# Altium schematic sheet STM32F103.SchDoc
size A3; SheetNumber: 1; SheetTotal: 6
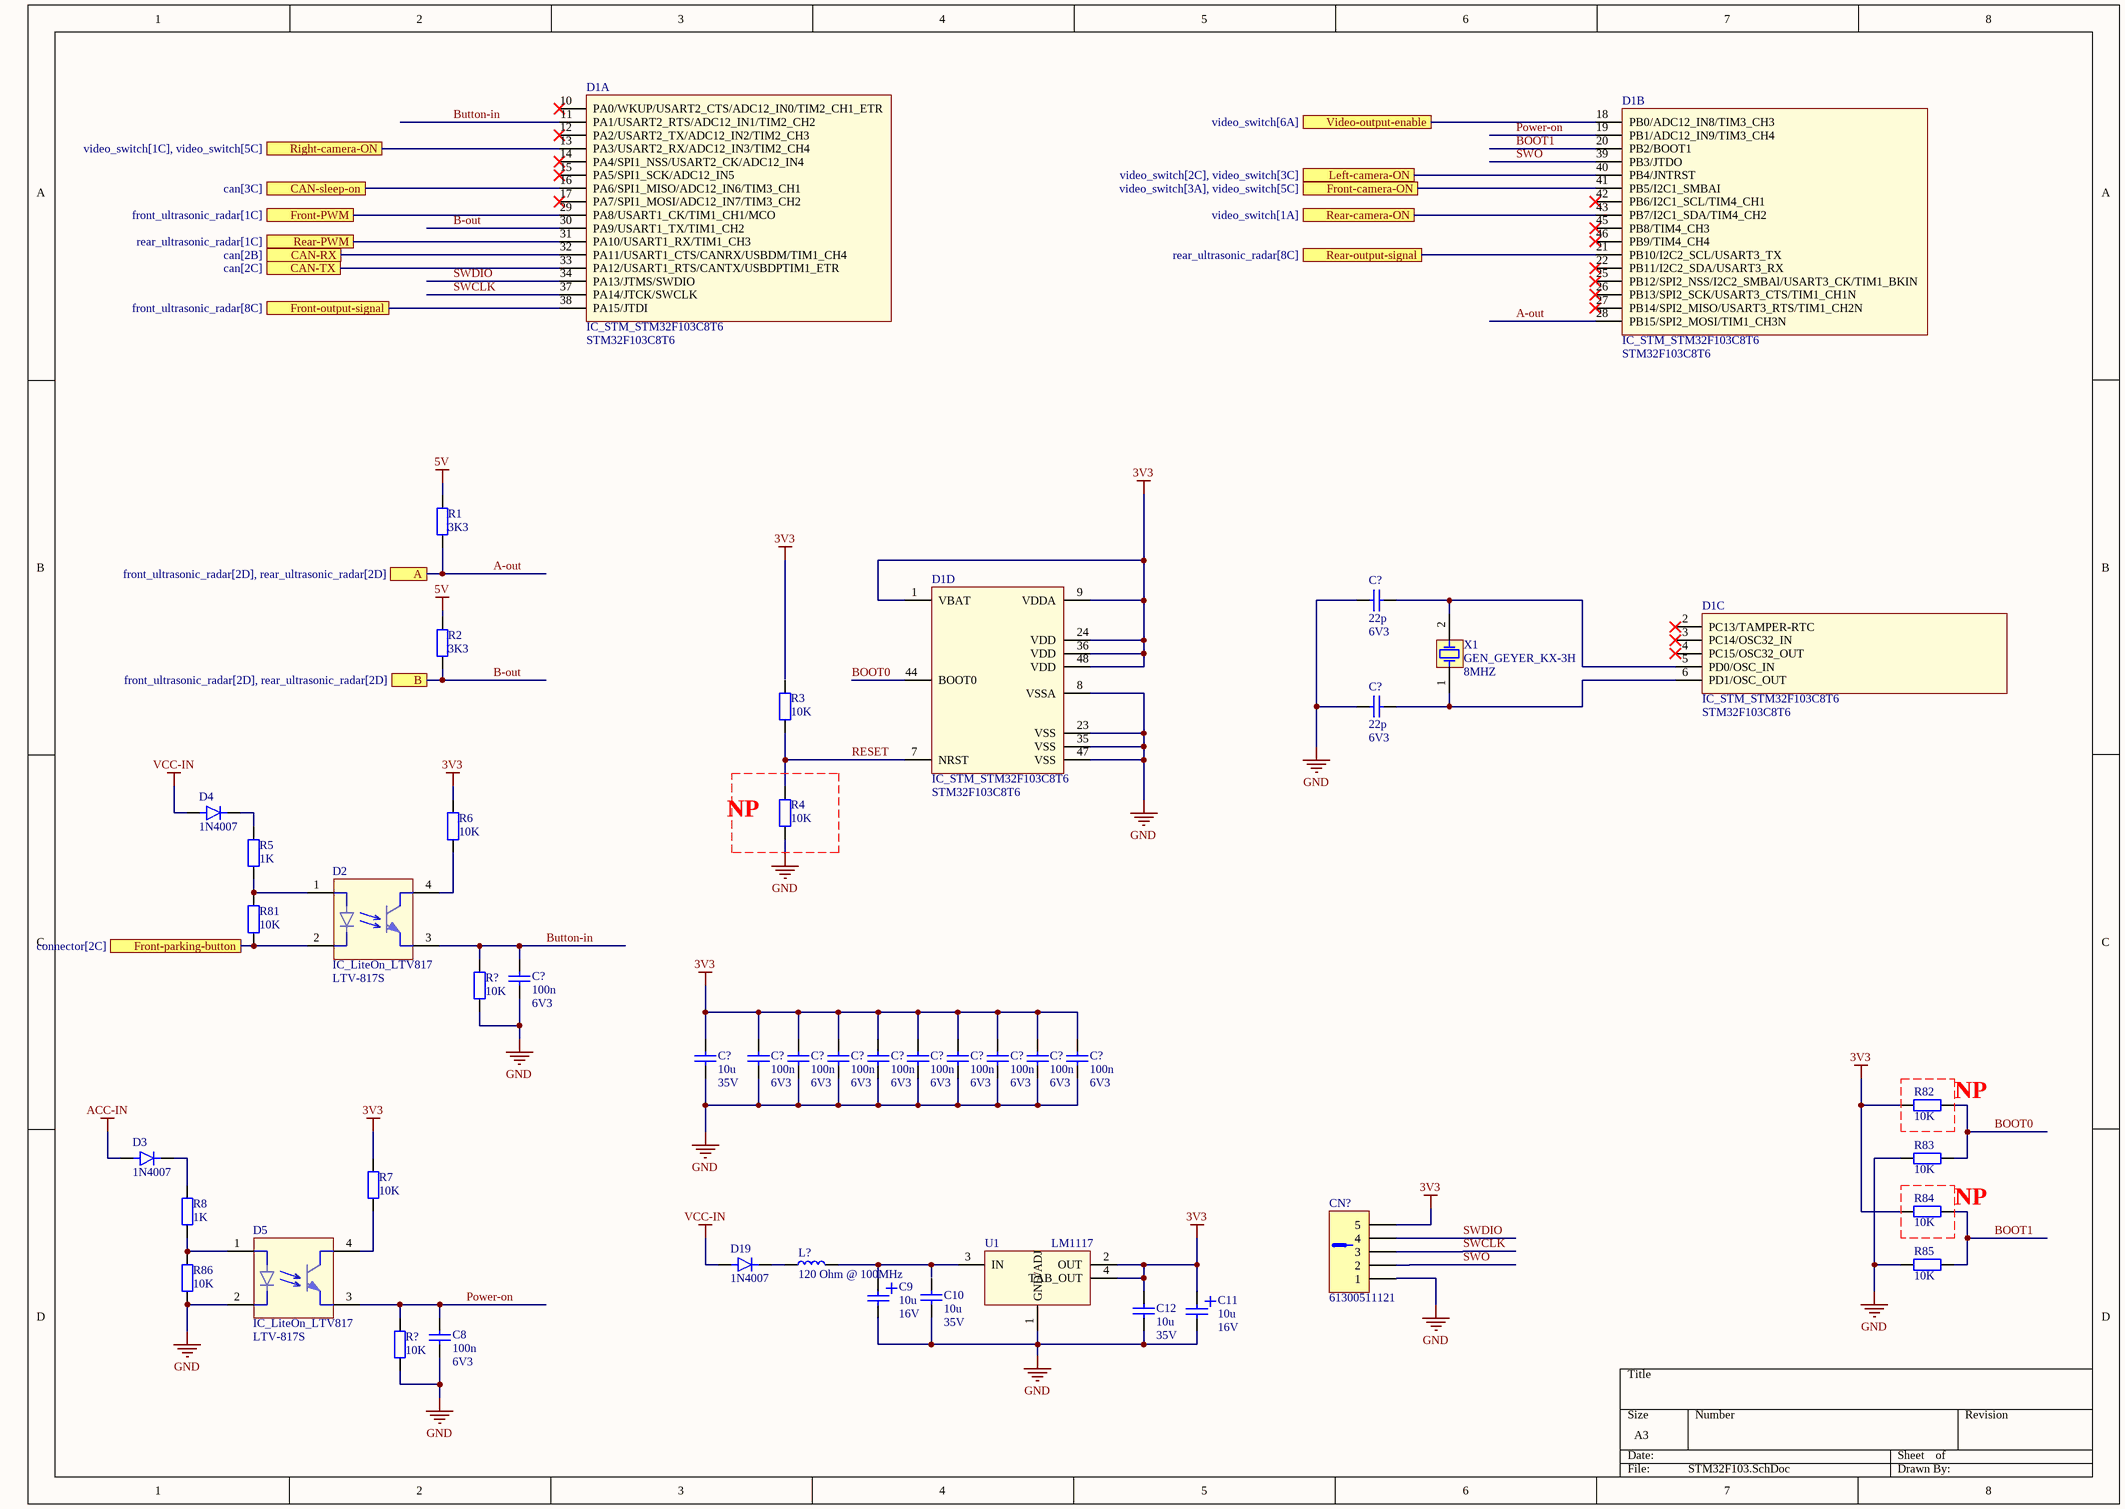
[diagram p0: STM32F103.SchDoc]

## Parts
(Parts that share a designator on the sheet are numbered #1, #2 ... from top to bottom, then left to right.)
C8  Value1: 100n  Value2: 6V3  [CAPC2012X88N]  (hidden comment: CAP)
C9  Value1: 10u  Value2: 16V  [CAPAE430X550N]  (hidden comment: CAP_POL)
C10  Value1: 10u  Value2: 35V  [CAPC3216X18N]  (hidden comment: CAP)
C11  Value1: 10u  Value2: 16V  [CAPAE430X550N]  (hidden comment: CAP_POL)
C12  Value1: 10u  Value2: 35V  [CAPC3216X18N]  (hidden comment: CAP)
C?#1  Value1: 22p  Value2: 6V3  [CAPC2012X88N]  (hidden comment: CAP)
C?#2  Value1: 22p  Value2: 6V3  [CAPC2012X88N]  (hidden comment: CAP)
C?#3  Value1: 100n  Value2: 6V3  [CAPC2012X88N]  (hidden comment: CAP)
C?#4  Value1: 10u  Value2: 35V  [CAPC3216X18N]  (hidden comment: CAP)
C?#5  Value1: 100n  Value2: 6V3  [CAPC2012X88N]  (hidden comment: CAP)
C?#6  Value1: 100n  Value2: 6V3  [CAPC2012X88N]  (hidden comment: CAP)
C?#7  Value1: 100n  Value2: 6V3  [CAPC2012X88N]  (hidden comment: CAP)
C?#8  Value1: 100n  Value2: 6V3  [CAPC2012X88N]  (hidden comment: CAP)
C?#9  Value1: 100n  Value2: 6V3  [CAPC2012X88N]  (hidden comment: CAP)
C?#10  Value1: 100n  Value2: 6V3  [CAPC2012X88N]  (hidden comment: CAP)
C?#11  Value1: 100n  Value2: 6V3  [CAPC2012X88N]  (hidden comment: CAP)
C?#12  Value1: 100n  Value2: 6V3  [CAPC2012X88N]  (hidden comment: CAP)
C?#13  Value1: 100n  Value2: 6V3  [CAPC2012X88N]  (hidden comment: CAP)
CN?  Value1: 61300511121  [CN_Wurth_61300511121]  (hidden comment: CN_1X5M)
D1  IC_STM_STM32F103C8T6  Value1: STM32F103C8T6  [TSQFP50P900X900X160-48N]  (parts A,B,C,D of 4)
D2  IC_LiteOn_LTV817  Value1: LTV-817S  [IC_LiteOn_ LTV-817S]
D3  Value1: 1N4007  [DO-214AC]  (hidden comment: DIO)
D4  Value1: 1N4007  [DO-214AC]  (hidden comment: DIO)
D5  IC_LiteOn_LTV817  Value1: LTV-817S  [IC_LiteOn_ LTV-817S]
D19  Value1: 1N4007  [DO-214AC]  (hidden comment: DIO)
L?  Value1: 120 Ohm @ 100MHz  [INDC1608X60N]  (hidden comment: IND)
R1  Value1: 3K3  [RESC2012X60N]  (hidden comment: RES)
R2  Value1: 3K3  [RESC2012X60N]  (hidden comment: RES)
R3  Value1: 10K  [RESC2012X60N]  (hidden comment: RES)
R4  Value1: 10K  [RESC2012X60N]  (hidden comment: RES)
R5  Value1: 1K  [RESC2012X60N]  (hidden comment: RES)
R6  Value1: 10K  [RESC2012X60N]  (hidden comment: RES)
R7  Value1: 10K  [RESC2012X60N]  (hidden comment: RES)
R8  Value1: 1K  [RESC2012X60N]  (hidden comment: RES)
R81  Value1: 10K  [RESC2012X60N]  (hidden comment: RES)
R82  Value1: 10K  [RESC2012X60N]  (hidden comment: RES)
R83  Value1: 10K  [RESC2012X60N]  (hidden comment: RES)
R84  Value1: 10K  [RESC2012X60N]  (hidden comment: RES)
R85  Value1: 10K  [RESC2012X60N]  (hidden comment: RES)
R86  Value1: 10K  [RESC2012X60N]  (hidden comment: RES)
R?#1  Value1: 10K  [RESC2012X60N]  (hidden comment: RES)
R?#2  Value1: 10K  [RESC2012X60N]  (hidden comment: RES)
U1  Value1: LM1117  [IC_TI_LM1117]  (hidden comment: IC_TI_LM1117)
X1  GEN_GEYER_KX-3H  Value1: 8MHZ  [GEN_GEYER_KX-3H]

## Ports
A (see front_ultrasonic_radar[2D], rear_ultrasonic_radar[2D]), B (see front_ultrasonic_radar[2D], rear_ultrasonic_radar[2D]), CAN-RX (see can[2B]), CAN-sleep-on (see can[3C]), CAN-TX (see can[2C]), Front-camera-ON (see video_switch[3A], video_switch[5C]), Front-output-signal (see front_ultrasonic_radar[8C]), Front-parking-button (see connector[2C]), Front-PWM (see front_ultrasonic_radar[1C]), Left-camera-ON (see video_switch[2C], video_switch[3C]), Rear-camera-ON (see video_switch[1A]), Rear-output-signal (see rear_ultrasonic_radar[8C]), Rear-PWM (see rear_ultrasonic_radar[1C]), Right-camera-ON (see video_switch[1C], video_switch[5C]), Video-output-enable (see video_switch[6A])

## Nets
3V3: C11.1 C?#4.2 C?#5.2 C?#6.2 C?#7.2 C?#8.2 C?#9.2 C?#10.2 C?#11.2 C?#12.2 C?#13.2 CN?.5 D1.1(VBAT) D1.9(VDDA) D1.24(VDD) D1.36(VDD) D1.48(VDD) R6.2 R7.2 R82.1 R84.1 U1.2(OUT) U1.4(TAB_OUT)
5V: R1.2 R2.2
ACC-IN: D3.1(A)
GND: C8.1 C9.2 C10.1 C11.2 C12.1 C?#1.1 C?#2.1 C?#3.1 C?#4.1 C?#5.1 C?#6.1 C?#7.1 C?#8.1 C?#9.1 C?#10.1 C?#11.1 C?#12.1 C?#13.1 CN?.1 D1.8(VSSA) D1.23(VSS) D1.35(VSS) D1.47(VSS) D5.2 R4.1 R83.1 R85.1 R86.1 R?#1.1 R?#2.1 U1.1(GND/ADJ)
VCC-IN: D4.1(A) D19.1(A)
A-out: D1.28(PB15/SPI2_MOSI/TIM1_CH3N) R1.1 ; port A
B-out: D1.30(PA9/USART1_TX/TIM1_CH2) R2.1 ; port B
BOOT0: D1.44(BOOT0) R82.2 R83.2
BOOT1: D1.20(PB2/BOOT1) R84.2 R85.2
Button-in: C?#3.2 D1.11(PA1/USART2_RTS/ADC12_IN1/TIM2_CH2) D2.3 R?#1.2
CAN-RX: D1.32(PA11/USART1_CTS/CANRX/USBDM/TIM1_CH4) ; port CAN-RX
CAN-sleep-on: D1.16(PA6/SPI1_MISO/ADC12_IN6/TIM3_CH1) ; port CAN-sleep-on
CAN-TX: D1.33(PA12/USART1_RTS/CANTX/USBDPTIM1_ETR) ; port CAN-TX
Front-camera-ON: D1.41(PB5/I2C1_SMBAI) ; port Front-camera-ON
Front-output-signal: D1.38(PA15/JTDI) ; port Front-output-signal
Front-parking-button: D2.2 R81.1 ; port Front-parking-button
Front-PWM: D1.29(PA8/USART1_CK/TIM1_CH1/MCO) ; port Front-PWM
Left-camera-ON: D1.40(PB4/JNTRST) ; port Left-camera-ON
Power-on: C8.2 D1.19(PB1/ADC12_IN9/TIM3_CH4) D5.3 R?#2.2
Rear-camera-ON: D1.43(PB7/I2C1_SDA/TIM4_CH2) ; port Rear-camera-ON
Rear-output-signal: D1.21(PB10/I2C2_SCL/USART3_TX) ; port Rear-output-signal
Rear-PWM: D1.31(PA10/USART1_RX/TIM1_CH3) ; port Rear-PWM
RESET: D1.7(NRST) R3.1
Right-camera-ON: D1.13(PA3/USART2_RX/ADC12_IN3/TIM2_CH4) ; port Right-camera-ON
SWCLK: CN?.3 D1.37(PA14/JTCK/SWCLK)
SWDIO: CN?.4 D1.34(PA13/JTMS/SWDIO)
SWO: CN?.2 D1.39(PB3/JTDO)
Video-output-enable: D1.18(PB0/ADC12_IN8/TIM3_CH3) ; port Video-output-enable
NetC9_1: C9.1 L?.1 U1.3(IN)
NetC?#1_2: C?#1.2 D1.5(PD0/OSC_IN) X1.2
NetC?#2_2: C?#2.2 D1.6(PD1/OSC_OUT) X1.1
NetD2_1: D2.1 R5.1 R81.2
NetD2_4: D2.4 R6.1
NetD3_2: D3.2(K) R8.2
NetD4_2: D4.2(K) R5.2
NetD5_1: D5.1 R8.1 R86.2
NetD5_4: D5.4 R7.1
NetD19_2: D19.2(K) L?.2

Not connected (* = marked no-connect by the designer): C10 2; C12 2; D1 2(PC13/TAMPER-RTC)* 3(PC14/OSC32_IN)* 4(PC15/OSC32_OUT)* 10(PA0/WKUP/USART2_CTS/ADC12_IN0/TIM2_CH1_ETR)* 12(PA2/USART2_TX/ADC12_IN2/TIM2_CH3)* 14(PA4/SPI1_NSS/USART2_CK/ADC12_IN4)* 15(PA5/SPI1_SCK/ADC12_IN5)* 17(PA7/SPI1_MOSI/ADC12_IN7/TIM3_CH2)* 22(PB11/I2C2_SDA/USART3_RX)* 25(PB12/SPI2_NSS/I2C2_SMBAl/USART3_CK/TIM1_BKIN)* 26(PB13/SPI2_SCK/USART3_CTS/TIM1_CH1N)* 27(PB14/SPI2_MISO/USART3_RTS/TIM1_CH2N)* 42(PB6/I2C1_SCL/TIM4_CH1)* 45(PB8/TIM4_CH3)* 46(PB9/TIM4_CH4)*; R3 2; R4 2

## Notes on the sheet
- (near R4) NP
- (near R82) NP
- (near R84) NP

## Library data of the parts
C8 C?#3 C?#5-C?#13 = 01_00637: X7R 10% 0805; Manufacturer: KEMET; Manufacturer PN: C0805C104K9RACTU; AutoId: 637; DeviceType: capacitor; SubType: Ceramic; Id: 01_00637; Status: 2 - Checked and Approved; MountType: SMT; ComponentLink1URL: X:\01_Datasheets\CAP_KEMET_CxxxxCxxxXxRAC.pdf; Supplier 1: Farnell; Supplier Part Number 1: 80-C0805C104K9R; ComponentLink1Description: Datasheet
C9 C11 = 01_01399: ELCO 20%; Manufacturer: Nichicon; Manufacturer PN: UWF1C100MCL1GB; AutoId: 1399; DeviceType: capacitor; SubType: Electrolyte; Id: 01_01399; Status: 2 - Checked and Approved; MountType: SMT; ComponentLink1URL: X:\01_Datasheets\CAP_NICHICON_UWF1C100MCL1GB.pdf; Supplier 1: Farnell; Supplier Part Number 1: 647-UWF1C100MCL1GB; ComponentLink1Description: Datasheet
C10 C12 C?#4 = 01_01484: MURATA - GRM31CR6YA106KA12L - CAP, MLCC, X5R, 10UF, 35V, 1206; AutoId: 1484; DeviceType: capacitor; SubType: Ceramic; Id: 01_01484; Manufacturer: Murata; Manufacturer PN: GRM31CR6YA106KA12L; Status: 2 - Checked and Approved; MountType: SMD; ComponentLink1URL: X:\01_dataSheets\CAP_MURATA_GRM31CR6YA106KA12L.pdf; Supplier 1: Farnell; Supplier Part Number 1: 1797011; ComponentLink1Description: Datasheet
C?#1 C?#2 = 01_00593: X7R 10% 0805; Manufacturer: KEMET; Manufacturer PN: C0805C220K9RACTU; AutoId: 593; DeviceType: capacitor; SubType: Ceramic; Id: 01_00593; Status: 2 - Checked and Approved; MountType: SMT; ComponentLink1URL: X:\01_Datasheets\CAP_KEMET_CxxxxCxxxXxRAC.pdf; Supplier 1: Farnell; ComponentLink1Description: Datasheet
CN? = 02_00139: Headers & Wire Housings WR-PHD 2.54mm Hdr 5P Single Str Gold; Manufacturer: Wurth; AutoId: 139; Value2: 5 pin; Value3: header; DeviceType: Connector_; Id: 02_00139; Manufacturer PN: 61300511121; Status: 0 - Unchecked; MountType: THT; ComponentLink1Description: Datasheet; ComponentLink1URL: X:\01_Datasheets\CN_Wurth_61300511121.pdf; ComponentLink2Description: ComponentVerificationSheet; ComponentLink2URL: X:\02_ComponentVerificationSheets\; Supplier 1: Mouser; Supplier Part Number 1: 710-61300511121
D1 = 07_00285: MCU 32BIT Cortex M3 64KB 20KB RAM 2X12 ADC; Manufacturer: STM; AutoId: 292; Value2: Microcontroller; Value3: ARM 32bit; DeviceType: IC; Id: 07_00285; Manufacturer PN: STM32F103C8T6; Status: 0 - Unchecked; MountType: SMT; ComponentLink1Description: Datasheet; ComponentLink1URL: X:\01_Datasheets\IC_STM_STM32F103C8T6.pdf; ComponentLink2Description: ComponentVerificationSheet; ComponentLink2URL: X:\02_ComponentVerificationSheets\; Supplier 1: Mouser; Supplier Part Number 1: 511-STM32F103C8T6
D2 D5 = 07_00275: Transistor Output Optocouplers Optocoupler Phototrans; Manufacturer: Lite-On; AutoId: 276; Id: 07_00275; Value2: Optocouplers; Value3: Optocouplers; Manufacturer PN: LTV-817S; DeviceType: Optocouple; Status: 0 - Unchecked; MountType: SMT; ComponentLink1Description: Datasheet; ComponentLink1URL: X:\01_Datasheets\IC_Lite_On_LTV-817S.pdf; ComponentLink2Description: ComponentVerificationSheet; ComponentLink2URL: X:\02_ComponentVerificationSheets\; Supplier 1: Mouser; Supplier Part Number 1: 859-LTV-817S
D3 D4 D19 = 03_00099: M7 Diode, max 30A; AutoId: 117; Value2: 1A, 400V; Id: 03_00099; Value3: M7; Manufacturer PN: 1N4007; DeviceType: diode; ComponentLink1Description: Datasheet; ComponentLink1URL: X:\01_Datasheets\; ComponentLink2Description: ComponentVerificationSheet; ComponentLink2URL: X:\02_ComponentVerificationSheets\
L? = 08_00132: MURATA - BLM18KG121TN1D - FERRITE BEAD, 0603, 120R, 3A; AutoId: 132; DeviceType: inductor; Id: 08_00132; Value2: 3A; Manufacturer: Murata; Manufacturer PN: BLM18KG121TN1D; Status: 0 - Unchecked; MountType: SMD; ComponentLink1Description: Datasheet; ComponentLink1URL: X:\01_dataSheets\IND_MURATA_BLM18K.pdf; ComponentLink2Description: ComponentVerificationSheet; ComponentLink2URL: X:\02_ComponentVerificationSheets\; Supplier 1: Farnell; Supplier Part Number 1: 1781089
R1 R2 = 15_00335: RESISTOR, 0805, 3K3, 1%, SMD; Manufacturer: Yageo; Manufacturer PN: RC0805FR-073K3; AutoId: 335; Value2: 0W125; SubType: Metal film; Id: 15_00335; DeviceType: resistor; Status: 2 - Checked and Approved; MountType: SMT; ComponentLink1Description: Datasheet; ComponentLink1URL: X:\01_Datasheets\RES_YAGEO_RC0805FR.pdf; Supplier 1: Farnell; Supplier Part Number 1: 9237682
R3 R4 R6 R7 R81-R86 R?#1 R?#2 = 15_00341: RESISTOR, 0805, 10K, 1%, SMD; Manufacturer: Yageo; Manufacturer PN: RC0805FR-0710K; AutoId: 341; Value2: 0W125; SubType: Metal film; Id: 15_00341; DeviceType: resistor; Status: 0 - Unchecked; MountType: SMT; ComponentLink1Description: Datasheet; ComponentLink1URL: X:\01_Datasheets\RES_YAGEO_RC0805FR.pdf; Supplier 1: Farnell
R5 R8 = 15_00329: RESISTOR, 0805, 1K, 1%, SMD; Manufacturer: Yageo; Manufacturer PN: RC0805FR-071K; AutoId: 329; Value2: 0W125; SubType: Metal film; Id: 15_00329; DeviceType: resistor; Status: 2 - Checked and Approved; MountType: SMT; ComponentLink1Description: Datasheet; ComponentLink1URL: X:\01_Datasheets\RES_YAGEO_RC0805FR.pdf; Supplier 1: Farnell; Supplier Part Number 1: 9237496
U1 = 07_00244: LDO Voltage Regulators 800MA LDO LINEAR REG; Manufacturer: TI; Manufacturer PN: LM1117MPX-3.3/NOPB; AutoId: 242; Value3: 3V3; Id: 07_00244; Value2: LDO; DeviceType: LDO; Status: 0 - Unchecked; MountType: SMT; ComponentLink1Description: Datasheet; ComponentLink1URL: X:\01_Datasheets\IC_TI_LM1117.pdf; ComponentLink2Description: ComponentVerificationSheet; ComponentLink2URL: X:\02_ComponentVerificationSheets\; Supplier 1: Mouser; Supplier Part Number 1: 926-LM1117MPX3.3NOPB
X1 = 06_00035: Crystals 8MHz; Manufacturer: GEYER; Manufacturer PN: KX-3H HC49S-8.000MHZ-20PF; AutoId: 36; Value2: 20 pF; Id: 06_00035; DeviceType: crystal; Status: 0 - Unchecked; MountType: SMT; ComponentLink1Description: Datasheet; ComponentLink1URL: X:\01_Datasheets\GEN_GEYER_KX-3H.pdf; ComponentLink2Description: ComponentVerificationSheet; ComponentLink2URL: X:\02_ComponentVerificationSheets\